# Altium schematic sheet TMC6100.SchDoc
size A4; SheetNumber: 3; SheetTotal: 7
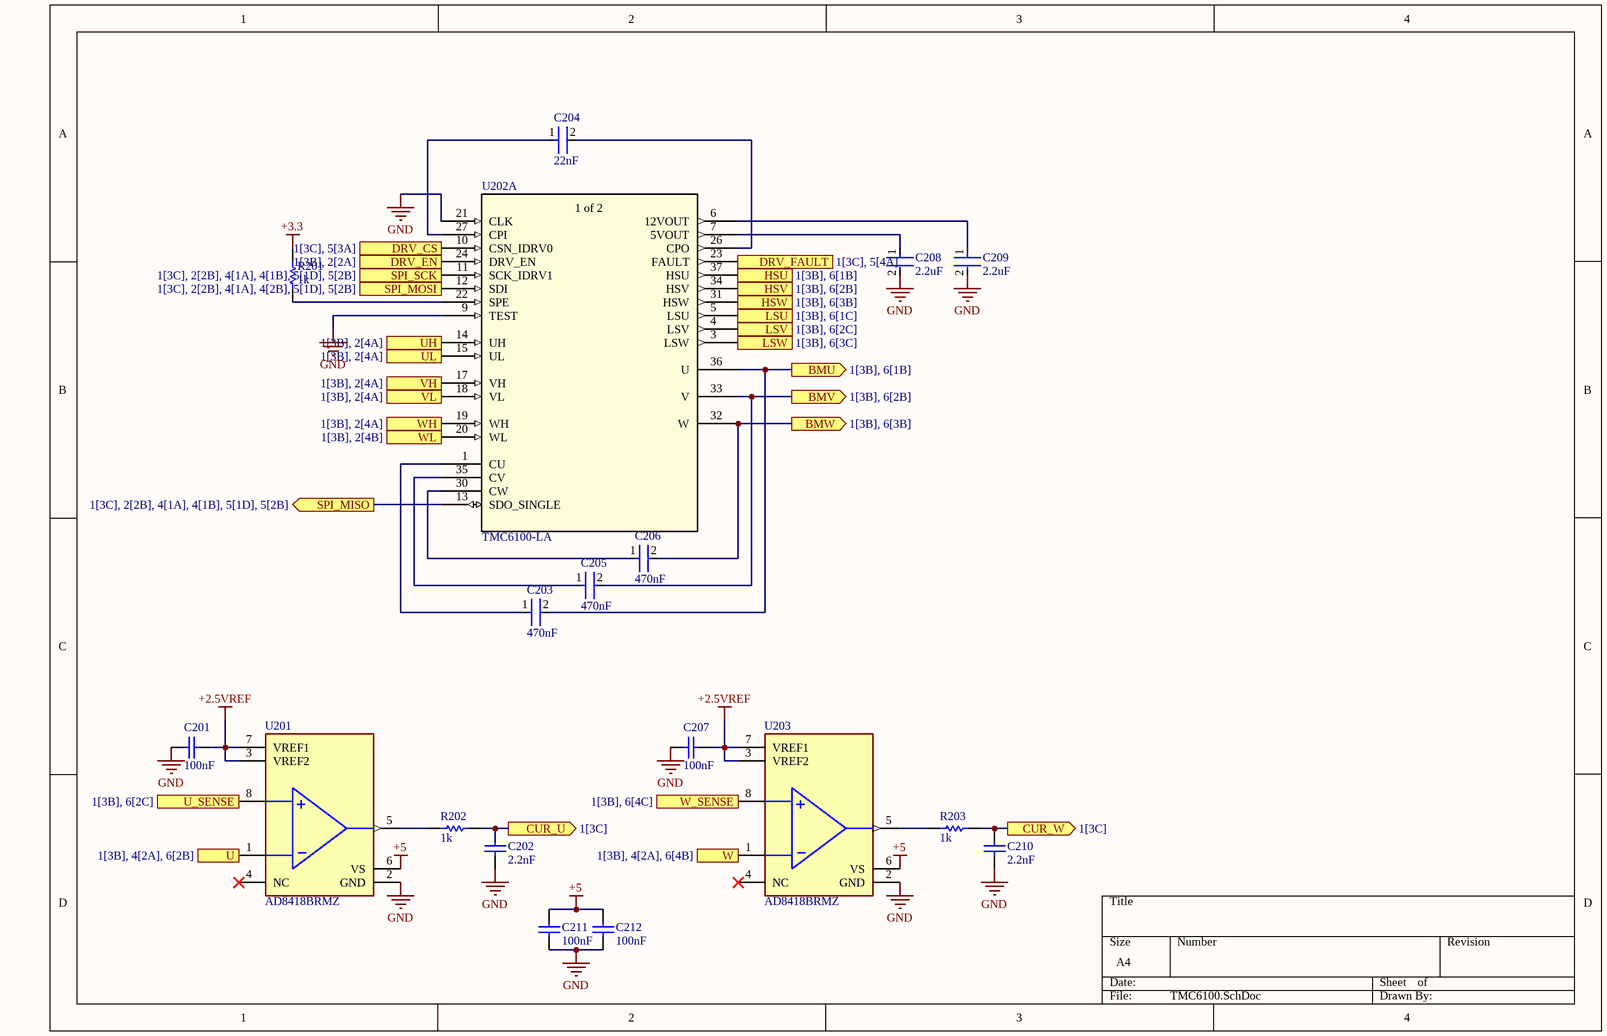
[diagram p0: TMC6100.SchDoc]

## Parts
C201  100nF  [CAPC1608X90X35NL10T15]
C202  2.2nF  [CAPC1608X95X40ML15T15]
C203  470nF  [FP-0603-L_1_6_0_1-W_0_8_0-IPC_B]
C204  22nF  [FP-C0603C-CF-MFG]
C205  470nF  [FP-0603-L_1_6_0_1-W_0_8_0-IPC_B]
C206  470nF  [FP-0603-L_1_6_0_1-W_0_8_0-IPC_B]
C207  100nF  [CAPC1608X90X35NL10T15]
C208  2.2uF  [FP-0603-L_1_6_0_2-W_0_8_0-IPC_B]
C209  2.2uF  [FP-0603-L_1_6_0_2-W_0_8_0-IPC_B]
C210  2.2nF  [CAPC1608X95X40ML15T15]
C211  100nF  [CAPC1608X90X35NL10T15]
C212  100nF  [CAPC1608X90X35NL10T15]
R201  1k  [RESC1608X55X30ML15T15]
R202  1k  [RESC1608X55X30ML15T15]
R203  1k  [RESC1608X55X30ML15T15]
U201  AD8418BRMZ  [FP-RM-8-IPC_B]
U202  TMC6100-LA  [QFN37_7X7_TRI-M]  (part A of 2)
U203  AD8418BRMZ  [FP-RM-8-IPC_B]

## Ports
BMU (out, see 1[3B], 6[1B]), BMV (out, see 1[3B], 6[2B]), BMW (out, see 1[3B], 6[3B]), CUR_U (out, see 1[3C]), CUR_W (out, see 1[3C]), DRV_CS (in, see 1[3C], 5[3A]), DRV_EN (in, see 1[3B], 2[2A]), DRV_FAULT (out, see 1[3C], 5[4A]), HSU (out, see 1[3B], 6[1B]), HSV (out, see 1[3B], 6[2B]), HSW (out, see 1[3B], 6[3B]), LSU (out, see 1[3B], 6[1C]), LSV (out, see 1[3B], 6[2C]), LSW (out, see 1[3B], 6[3C]), SPI_MISO (out, see 1[3C], 2[2B], 4[1A], 4[1B], 5[1D], 5[2B]), SPI_MOSI (in, see 1[3C], 2[2B], 4[1A], 4[2B], 5[1D], 5[2B]), SPI_SCK (in, see 1[3C], 2[2B], 4[1A], 4[1B], 5[1D], 5[2B]), U (in, see 1[3B], 4[2A], 6[2B]), U_SENSE (in, see 1[3B], 6[2C]), UH (in, see 1[3B], 2[4A]), UL (in, see 1[3B], 2[4A]), VH (in, see 1[3B], 2[4A]), VL (in, see 1[3B], 2[4A]), W (see 1[3B], 4[2A], 6[4B]), W_SENSE (see 1[3B], 6[4C]), WH (in, see 1[3B], 2[4A]), WL (in, see 1[3B], 2[4B])

## Nets
+2.5VREF: C201.1 C207.1 U201.3(VREF2) U201.7(VREF1) U203.3(VREF2) U203.7(VREF1)
+3.3: R201.2
+5: C211.1 C212.1 U201.6(VS) U203.6(VS)
GND: C201.2 C202.1 C207.2 C208.2 C209.2 C210.1 C211.2 C212.2 U201.2(GND) U202.9(TEST) U202.21(CLK) U203.2(GND)
BMU: C203.2 U202.36(U) ; port BMU
BMV: C205.2 U202.33(V) ; port BMV
BMW: C206.2 U202.32(W) ; port BMW
CUR_U: C202.2 R202.2 ; port CUR_U
CUR_W: C210.2 R203.2 ; port CUR_W
DRV_CS: U202.10(CSN_IDRV0) ; port DRV_CS
DRV_EN: U202.24(DRV_EN) ; port DRV_EN
DRV_FAULT: U202.23(FAULT) ; port DRV_FAULT
HSU: U202.37(HSU) ; port HSU
HSV: U202.34(HSV) ; port HSV
HSW: U202.31(HSW) ; port HSW
LSU: U202.5(LSU) ; port LSU
LSV: U202.4(LSV) ; port LSV
LSW: U202.3(LSW) ; port LSW
SPI_MISO: U202.13(SDO_SINGLE) ; port SPI_MISO
SPI_MOSI: U202.12(SDI) ; port SPI_MOSI
SPI_SCK: U202.11(SCK_IDRV1) ; port SPI_SCK
U: U201.1(-IN) ; port U
U_SENSE: U201.8(+IN) ; port U_SENSE
UH: U202.14(UH) ; port UH
UL: U202.15(UL) ; port UL
VH: U202.17(VH) ; port VH
VL: U202.18(VL) ; port VL
W: U203.1(-IN) ; port W
W_SENSE: U203.8(+IN) ; port W_SENSE
WH: U202.19(WH) ; port WH
WL: U202.20(WL) ; port WL
NetC203_1: C203.1 U202.1(CU)
NetC204_1: C204.1 U202.27(CPI)
NetC204_2: C204.2 U202.26(CPO)
NetC205_1: C205.1 U202.35(CV)
NetC206_1: C206.1 U202.30(CW)
NetC208_1: C208.1 U202.7(5VOUT)
NetC209_1: C209.1 U202.6(12VOUT)
NetR201_1: R201.1 U202.22(SPE)
NetR202_1: R202.1 U201.5(OUT)
NetR203_1: R203.1 U203.5(OUT)

Not connected (* = marked no-connect by the designer): U201 4(NC)*; U203 4(NC)*

## Notes on the sheet
- (in symbol TMC6100-LA, part A) 1 of 2

## Library data of the parts
C201 C207 C211 C212 = CMP-2100-03643-1: Chip Capacitor, 0.1 uF, +/- 10%, 50 V, -55 to 125 degC, 0603 (1608 Metric), RoHS, Tape and Reel; Manufacturer: Murata; Dielectric Material: Ceramic; Voltage Rating: 50V; Dielectric: X7R; Insulation Resistance: 10GR; Case Code (Metric): 1608; Lead Free: LeadFree; Depth: 0.8mm; Number of Pins: 2; Radiation Hardening: No; Case/Package: 0603; Manufacturer URL: http://www.murata.com/; Packaging: TapeandReel; Length: 1.6mm; Contact Plating: Tin; Datasheet URL: http://psearch.en.murata.com/capacitor/product/GRM188R71H104KA93%23.pdf; Tolerance: 10%; Case Code (Imperial): 0603; Min Operating Temperature: -55degC; RoHSCompliant: true; Capacitance: 100nF; Voltage: 50V; Termination: SMD/SMT; Mount: SurfaceMount; Material: Ceramic; Package Quantity: 1; Height: 0.8mm; Thickness: 0.035inch; REACH SVHC: NoSVHC; Max Operating Temperature: 125degC; Width: 0.8mm; Package Reference: 0603; Voltage Rating (DC): 50V; Datasheet Version: 42675.0; Package Description: 2-Pin Surface Mount Device, Body 1.6 x 0.8 mm
C202 C210 = CMP-2006-00064-1: Manufacturer: Vitramon; Part Number: VJ0603Y222KXACW1BC
C203 C205 C206 = CMP-14477-000135-2: None; Dielectric: X7R; Voltage Rating: 50V; Tolerance: 10%; Series: M; Package Quantity: 1; Radiation Hardening: No; Packaging: Tape and Reel; Length: 1.6mm; Min Operating Temperature: -55°C; Case Code (Imperial): 0603; Capacitance: 470nF; Construction: Flat; Max Operating Temperature: 125°C; Thickness: 0.035inch; Case Code (Metric): 1608; Depth: 0.8mm; Voltage: 50V; Case/Package: 0603; RoHS Compliant: Yes; Mount: Surface Mount; Lead Free: Lead Free; Width: 0.031inch; Halogen Free: Halogen Free; Height: 0.8mm; Termination: SMD/SMT; Voltage Rating (DC): 50V
C204 = CMP-2006-03137-2: CAP CER 0.022UF 100V X7R 0603; Manufacturer: KEMET; Manufacturer Part Number: C0603C223K1RACTU; Material: Ceramic; Temperature Coefficient: 30ppm/°C; Value: 22,000 pF; Tolerance: 0.1; Automotive Grade: Grade 1; Voltage Rating: 100 V; Temperature Range High: +125°C; Temperature: -55°C to +125°C; Digikey Description: CAP CER 0.022UF 100V X7R 0603; Lead Free: Yes; ComponentLink2Description: Datasheet; Height: 0.87mm; Category: Cap; Device Class L3: Ceramic Capacitors; Device Class L2: Capacitors; Octopart: https://octopart.com/c0603c223k1ractu-kemet-150702; Package: C0603C-CF; Temperature Characteristic: X7R; Automotive: Yes; ComponentLink2URL: https://api.kemet.com/component-edge/download/datasheet/C0603C100J5GACAUTO.pdf; Capacitance: 22,000 pF; Temperature Range Low: -55°C; Device Class L1: Passive Components; RoHS: TRUE; Mouser Description: Multilayer Ceramic Capacitors MLCC - SMD/SMT 100volts 0.022uF 10% X7R
C208 C209 = CMP-14477-000078-3: Multilayer Ceramic Capacitor 2.2uF 16V X7R 10% SMD 0603 T/R; Width: 0.031inch; Tolerance: 10%; Thickness: 0.035inch; Case/Package: 0603; Voltage Rating (DC): 16V; Voltage Rating: 16V; Halogen Free: Halogen Free; RoHS Compliant: Yes; Min Operating Temperature: -55°C; Length: 0.063inch; Mount: Surface Mount; Capacitance: 2.2uF; Max Operating Temperature: 125°C; Packaging: Tape and Reel
R201-R203 = CMP-2000-00180-1: Part Number: ERJ-3EKF1001V; Manufacturer: Panasonic
U201 U203 = CMP-09116-000026-1: IC CURR SENSE 1 CIRCUIT 8MSOP; Manufacturer: Analog Devices; Min Supply Voltage: 2.7V; Input Bias Current: 130uA; Number Of Channels: 1; Max Supply Voltage: 5.5V; Voltage Gain: 0.02V/mV; Bandwidth: 250kHz; Standoff Height: 0.05mm; Nominal Supply Current: 2.6mA; Input Offset Voltage: 0.2mV; Automotive: No; Temperature: -40°C to +125°C; Octopart: https://octopart.com/ad8418brmz-analog+devices-21054230; ComponentLink2Description: Datasheet; Device Class L1: Integrated Circuits (ICs); ComponentLink2URL: https://www.analog.com/media/en/technical-documentation/data-sheets/AD8418.pdf; Digikey Description: IC CURR SENSE 1 CIRCUIT 8MSOP; Ipc Land Pattern Name: SOP65P490X110-8; Temperature Range Low: -40°C; Device Class L3: Instrumentation; Height: 1.1mm; Mouser Description: Current Sense Amplifier, Bidirectional, 1, 130 A, MSOP, 8, -40 C, 125 C; Lead Free: Yes; Manufacturer Part Number: AD8418BRMZ; Category: IC; Package: RM-8; Device Class L2: Linear ICs; Temperature Range High: +125°C; RoHS: TRUE
U202 = TMC6100-LA: No Description Available; Mfr_Name: Trinamic; RefDes: RefDes; Type: Type